# EAGLE design PCB (EAGLE 9.6.2)
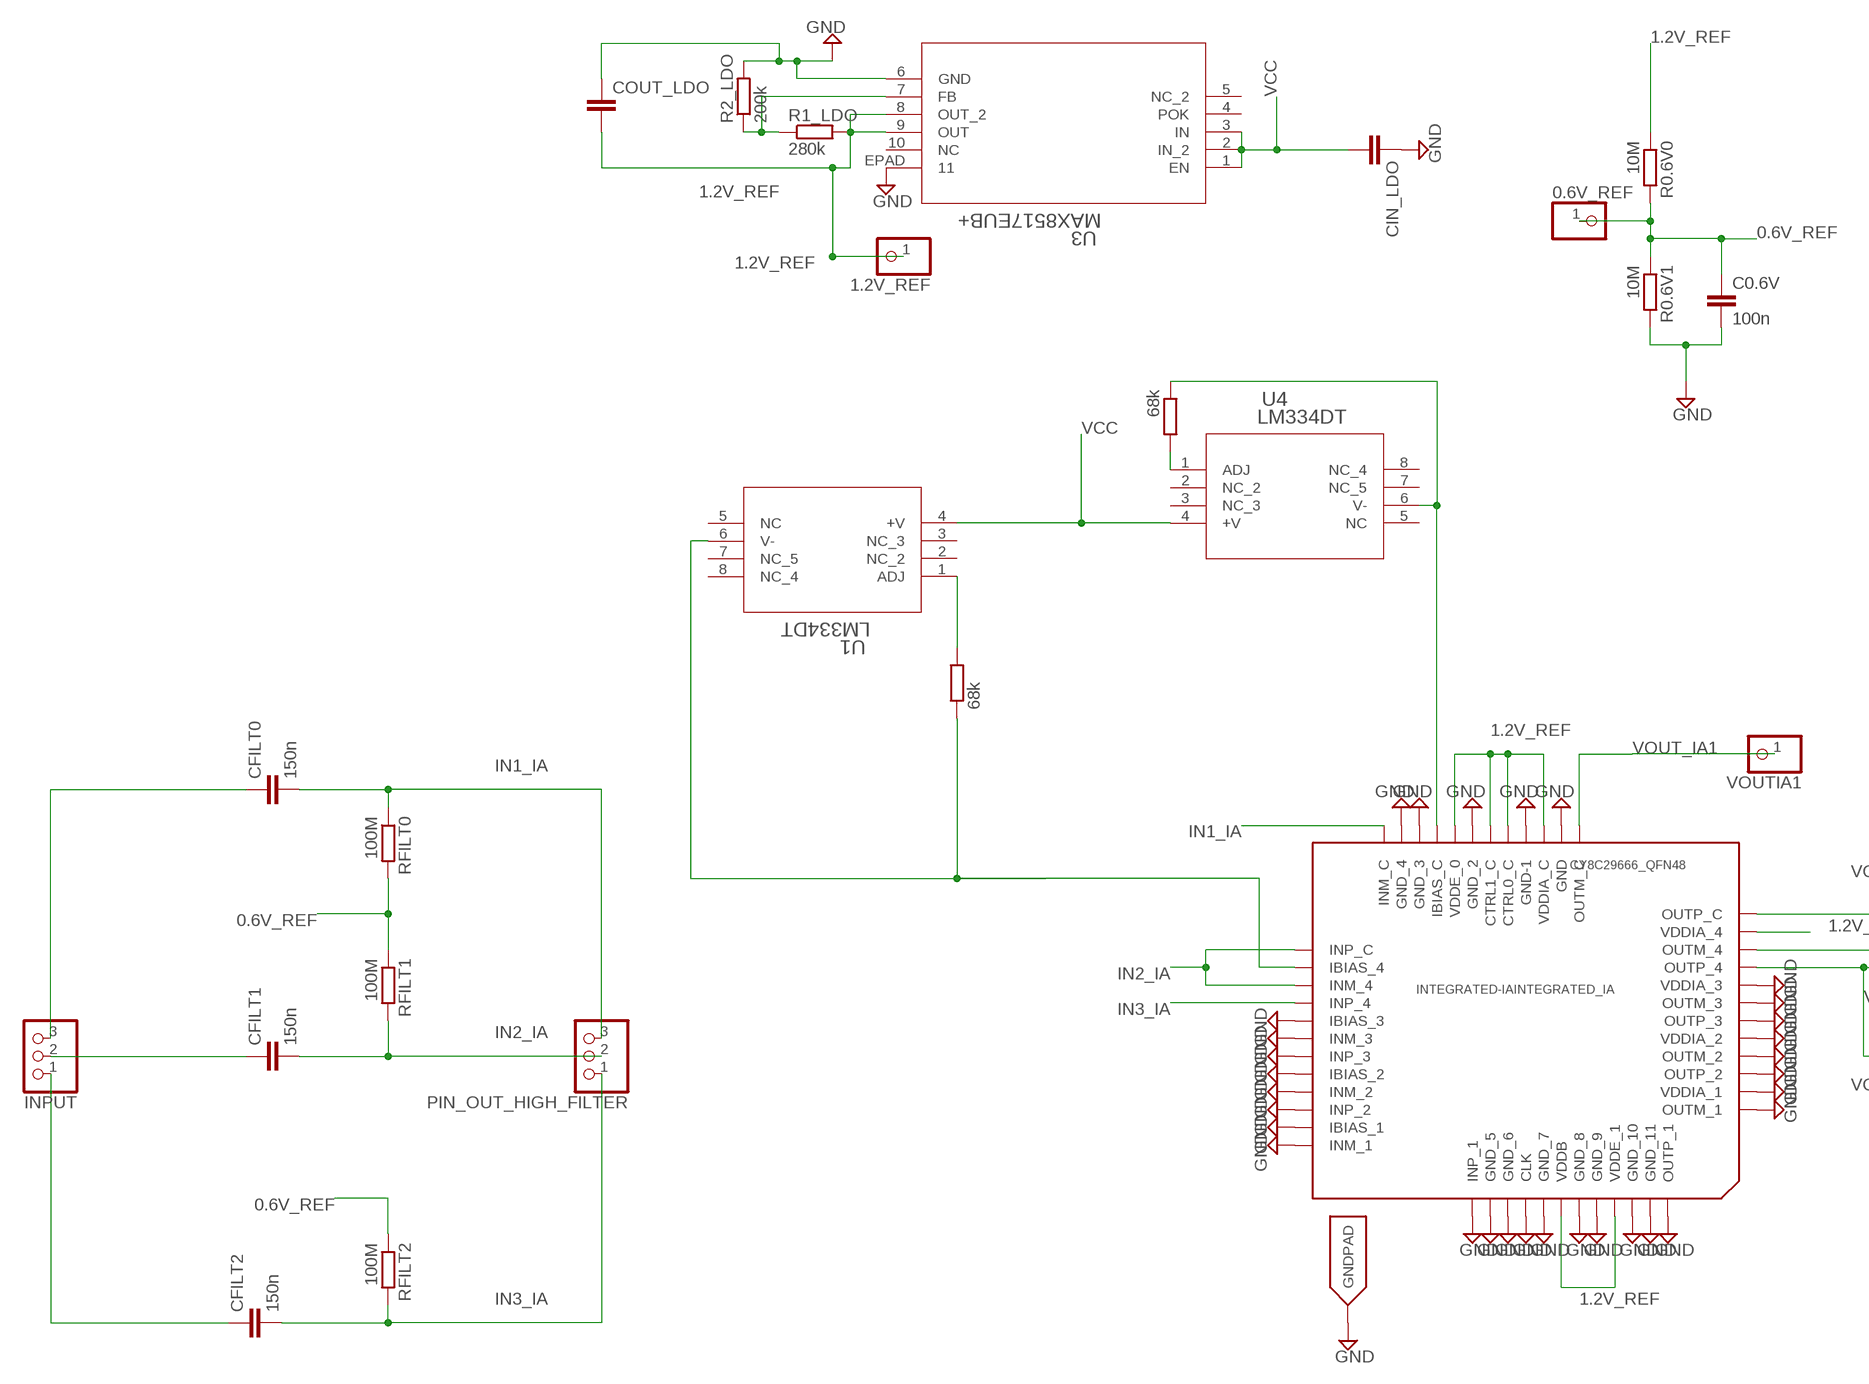
[diagram p0: schematic, sheet 1, part 1 of 2]
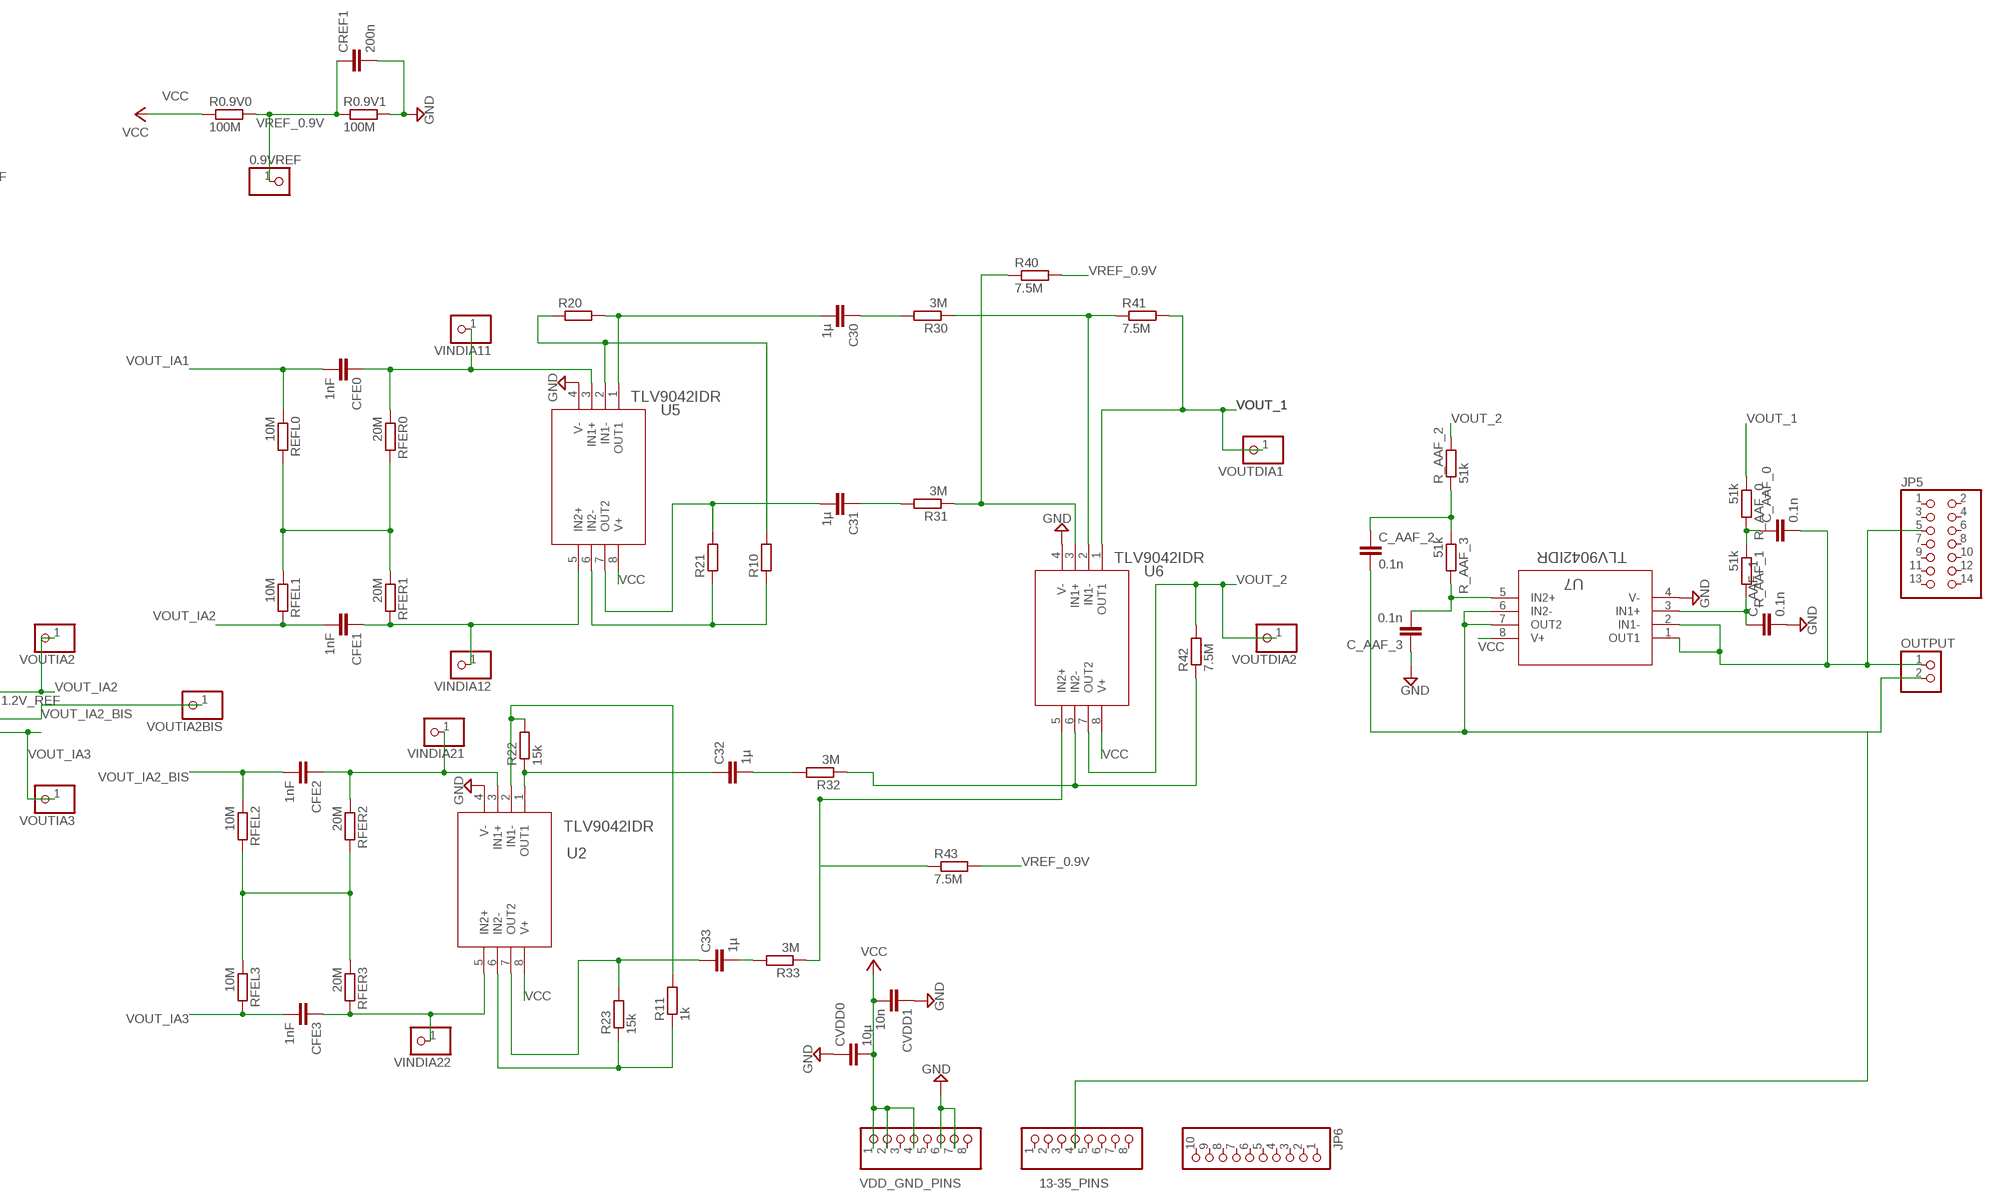
[diagram p1: schematic, sheet 1, part 2 of 2]

## Parts
0.6V_REF  PINHD-1X1  [1X01]
0.9VREF  PINHD-1X1  [1X01]
1.2V_REF  PINHD-1X1  [1X01]
13-35_PINS  PINHD-1X8  [1X08]
C0.6V  100n  C-EUC0603  [C0603]
C30  1µ  C-EUC0603  [C0603]
C31  1µ  C-EUC0603  [C0603]
C32  1µ  C-EUC0603  [C0603]
C33  1µ  C-EUC0603  [C0603]
C_AAF_0  0.1n  C-EUC0603  [C0603]
C_AAF_1  0.1n  C-EUC0603  [C0603]
C_AAF_2  0.1n  C-EUC0603  [C0603]
C_AAF_3  0.1n  C-EUC0603  [C0603]
CFE0  1nF  C-EUC0603  [C0603]
CFE1  1nF  C-EUC0603  [C0603]
CFE2  1nF  C-EUC0603  [C0603]
CFE3  1nF  C-EUC0603  [C0603]
CFILT0  150n  C-EUC0603  [C0603]
CFILT1  150n  C-EUC0603  [C0603]
CFILT2  150n  C-EUC0603  [C0603]
CIN_LDO  1µ  C-EUC0603  [C0603]
COUT_LDO  4.7µ  C-EUC0603  [C0603]
CREF1  200n  C-EUC0603  [C0603]
CVDD0  10µ  C-EUC0603  [C0603]
CVDD1  10n  C-EUC0603  [C0603]
INPUT  PINHD-1X3  [1X03]
INTEGRATED-IA  CY8C29666_QFN48  [QFN48]
JP5  PINHD-2X7  [2X07]
JP6  PINHD-1X10  [1X10]
OUTPUT  PINHD-1X2  [1X02]
PIN_OUT_HIGH_FILTER  PINHD-1X3  [1X03]
R0.6V0  10M  R-EU_R0603  [R0603]
R0.6V1  10M  R-EU_R0603  [R0603]
R0.9V0  100M  R-EU_R0603  [R0603]
R0.9V1  100M  R-EU_R0603  [R0603]
R1_LDO  280k  R-EU_R0603  [R0603]
R2_LDO  200k  R-EU_R0603  [R0603]
R10  R-EU_R0603  [R0603]
R11  1k  R-EU_R0603  [R0603]
R20  R-EU_R0603  [R0603]
R21  R-EU_R0603  [R0603]
R22  15k  R-EU_R0603  [R0603]
R23  15k  R-EU_R0603  [R0603]
R30  3M  R-EU_R0603  [R0603]
R31  3M  R-EU_R0603  [R0603]
R32  3M  R-EU_R0603  [R0603]
R33  3M  R-EU_R0603  [R0603]
R40  7.5M  R-EU_R0603  [R0603]
R41  7.5M  R-EU_R0603  [R0603]
R42  7.5M  R-EU_R0603  [R0603]
R43  7.5M  R-EU_R0603  [R0603]
R_AAF_0  51k  R-EU_R0603  [R0603]
R_AAF_1  51k  R-EU_R0603  [R0603]
R_AAF_2  51k  R-EU_R0603  [R0603]
R_AAF_3  51k  R-EU_R0603  [R0603]
REFL0  10M  R-EU_R0603  [R0603]
RFEL1  10M  R-EU_R0603  [R0603]
RFEL2  10M  R-EU_R0603  [R0603]
RFEL3  10M  R-EU_R0603  [R0603]
RFER0  20M  R-EU_R0603  [R0603]
RFER1  20M  R-EU_R0603  [R0603]
RFER2  20M  R-EU_R0603  [R0603]
RFER3  20M  R-EU_R0603  [R0603]
RFILT0  100M  R-EU_R0603  [R0603]
RFILT1  100M  R-EU_R0603  [R0603]
RFILT2  100M  R-EU_R0603  [R0603]
RLM334_0  68k  R-EU_R0603  [R0603]
RLM334_1  68k  R-EU_R0603  [R0603]
U1  LM334DT  [SO-8_STM]
U2  TLV9042IDR  [SOIC8_D_TEX]
U3  MAX8517EUB+  [21-0109D_MXM]
U4  LM334DT  [SO-8_STM]
U5  TLV9042IDR  [SOIC8_D_TEX]
U6  TLV9042IDR  [SOIC8_D_TEX]
U7  TLV9042IDR  [SOIC8_D_TEX]
VDD_GND_PINS  PINHD-1X8  [1X08]
VINDIA11  PINHD-1X1  [1X01]
VINDIA12  PINHD-1X1  [1X01]
VINDIA21  PINHD-1X1  [1X01]
VINDIA22  PINHD-1X1  [1X01]
VOUTDIA1  PINHD-1X1  [1X01]
VOUTDIA2  PINHD-1X1  [1X01]
VOUTIA1  PINHD-1X1  [1X01]
VOUTIA2  PINHD-1X1  [1X01]
VOUTIA2BIS  PINHD-1X1  [1X01]
VOUTIA3  PINHD-1X1  [1X01]

## Nets
0.6V_REF: 0.6V_REF.1 C0.6V.1 R0.6V0.2 R0.6V1.1 RFILT0.2 RFILT1.1 RFILT2.1
1.2V_REF: 1.2V_REF.1 COUT_LDO.2 INTEGRATED-IA.11(INTEGRATED_IA:VDDIA_4) INTEGRATED-IA.15(INTEGRATED_IA:VDDIA_C) INTEGRATED-IA.17(INTEGRATED_IA:CTRL0_C) INTEGRATED-IA.18(INTEGRATED_IA:CTRL1_C) INTEGRATED-IA.20(INTEGRATED_IA:VDDE_0) INTEGRATED-IA.42(INTEGRATED_IA:VDDB) INTEGRATED-IA.45(INTEGRATED_IA:VDDE_1) R0.6V0.1 R1_LDO.2 U3.8(OUT_2) U3.9(OUT)
GND: C0.6V.2 C_AAF_1.2 C_AAF_3.1 CIN_LDO.1 COUT_LDO.1 CREF1.2 CVDD0.1 CVDD1.1 INTEGRATED-IA.1(INTEGRATED_IA:OUTM_1) INTEGRATED-IA.2(INTEGRATED_IA:VDDIA_1) INTEGRATED-IA.3(INTEGRATED_IA:OUTP_2) INTEGRATED-IA.4(INTEGRATED_IA:OUTM_2) INTEGRATED-IA.5(INTEGRATED_IA:VDDIA_2) INTEGRATED-IA.6(INTEGRATED_IA:OUTP_3) INTEGRATED-IA.7(INTEGRATED_IA:OUTM_3) INTEGRATED-IA.8(INTEGRATED_IA:VDDIA_3) INTEGRATED-IA.14(INTEGRATED_IA:GND) INTEGRATED-IA.16(INTEGRATED_IA:GND-1) INTEGRATED-IA.19(INTEGRATED_IA:GND_2) INTEGRATED-IA.22(INTEGRATED_IA:GND_3) INTEGRATED-IA.23(INTEGRATED_IA:GND_4) INTEGRATED-IA.29(INTEGRATED_IA:IBIAS_3) INTEGRATED-IA.30(INTEGRATED_IA:INM_3) INTEGRATED-IA.31(INTEGRATED_IA:INP_3) INTEGRATED-IA.32(INTEGRATED_IA:IBIAS_2) INTEGRATED-IA.33(INTEGRATED_IA:INM_2) INTEGRATED-IA.34(INTEGRATED_IA:INP_2) INTEGRATED-IA.35(INTEGRATED_IA:IBIAS_1) INTEGRATED-IA.36(INTEGRATED_IA:INM_1) INTEGRATED-IA.37(INTEGRATED_IA:INP_1) INTEGRATED-IA.38(INTEGRATED_IA:GND_5) INTEGRATED-IA.39(INTEGRATED_IA:GND_6) INTEGRATED-IA.40(INTEGRATED_IA:CLK) INTEGRATED-IA.41(INTEGRATED_IA:GND_7) INTEGRATED-IA.43(INTEGRATED_IA:GND_8) INTEGRATED-IA.44(INTEGRATED_IA:GND_9) INTEGRATED-IA.46(INTEGRATED_IA:GND_10) INTEGRATED-IA.47(INTEGRATED_IA:GND_11) INTEGRATED-IA.48(INTEGRATED_IA:OUTP_1) INTEGRATED-IA.EXP(GNDPAD) R0.6V1.2 R0.9V1.2 R2_LDO.2 U2.4(V-) U3.6(GND) U3.EPAD U5.4(V-) U6.4(V-) U7.4(V-) VDD_GND_PINS.6 VDD_GND_PINS.7
IN1_IA: CFILT0.2 INTEGRATED-IA.24(INTEGRATED_IA:INM_C) PIN_OUT_HIGH_FILTER.3 RFILT0.1
IN2_IA: CFILT1.2 INTEGRATED-IA.25(INTEGRATED_IA:INP_C) INTEGRATED-IA.27(INTEGRATED_IA:INM_4) PIN_OUT_HIGH_FILTER.2 RFILT1.2
IN3_IA: CFILT2.2 INTEGRATED-IA.28(INTEGRATED_IA:INP_4) PIN_OUT_HIGH_FILTER.1 RFILT2.2
N$1: C33.2 R33.2
N$2: C32.1 R22.1 U2.1(OUT1)
N$3: C32.2 R32.2
N$4: R32.1 R42.1 U6.6(IN2-)
N$5: CFILT2.1 INPUT.1
N$6: R33.1 R43.1 U6.5(IN2+)
N$7: REFL0.2 RFEL1.1 RFER0.2 RFER1.1
N$8: R31.1 R40.1 U6.3(IN1+)
N$9: C31.1 R31.2
N$10: C30.1 R30.2
N$11: C31.2 R21.2 U5.7(OUT2)
N$12: RLM334_1.2 U1.1(ADJ)
N$14: CFILT0.1 INPUT.3
N$16: R1_LDO.1 R2_LDO.1 U3.7(FB)
N$17: RLM334_0.2 U4.1(ADJ)
N$18: C_AAF_2.1 R_AAF_2.1 R_AAF_3.1
N$20: C30.2 R20.2 U5.1(OUT1)
N$21: C_AAF_0.1 R_AAF_0.2 R_AAF_1.1
N$22: C_AAF_1.1 R_AAF_1.2 U7.3(IN1+)
N$23: C_AAF_3.2 R_AAF_3.2 U7.5(IN2+)
N$24: 13-35_PINS.4 C_AAF_2.2 OUTPUT.2 U7.6(IN2-) U7.7(OUT2)
N$25: C_AAF_0.2 JP5.5 OUTPUT.1 U7.1(OUT1) U7.2(IN1-)
N$26: R30.1 R41.1 U6.2(IN1-)
N$27: R10.1 R21.1 U5.6(IN2-)
N$28: C33.1 R23.2 U2.7(OUT2)
N$29: R11.1 R23.1 U2.6(IN2-)
N$30: R10.2 R20.1 U5.2(IN1-)
N$31: INTEGRATED-IA.26(INTEGRATED_IA:IBIAS_4) RLM334_1.1 U1.6(V-)
N$32: R11.2 R22.2 U2.2(IN1-)
N$33: CFE3.1 RFER3.2 U2.5(IN2+) VINDIA22.1
N$34: RFEL2.2 RFEL3.1 RFER2.2 RFER3.1
N$36: CFE2.1 RFER2.1 U2.3(IN1+) VINDIA21.1
N$38: INTEGRATED-IA.21(INTEGRATED_IA:IBIAS_C) RLM334_0.1 U4.6(V-)
N$39: CFE0.1 RFER0.1 U5.3(IN1+) VINDIA11.1
N$40: CFE1.1 RFER1.2 U5.5(IN2+) VINDIA12.1
N$45: CFILT1.1 INPUT.2
VCC: CIN_LDO.2 CVDD0.2 CVDD1.2 R0.9V0.1 U1.4(+V) U2.8(V+) U3.1(EN) U3.2(IN_2) U3.3(IN) U4.4(+V) U5.8(V+) U6.8(V+) U7.8(V+) VDD_GND_PINS.1 VDD_GND_PINS.2 VDD_GND_PINS.4
VOUT_1: R41.2 R_AAF_0.1 U6.1(OUT1) VOUTDIA1.1
VOUT_2: R42.2 R_AAF_2.2 U6.7(OUT2) VOUTDIA2.1
VOUT_IA1: CFE0.2 INTEGRATED-IA.13(INTEGRATED_IA:OUTM_C) REFL0.1 VOUTIA1.1
VOUT_IA2: CFE1.2 INTEGRATED-IA.12(INTEGRATED_IA:OUTP_C) RFEL1.2 VOUTIA2.1
VOUT_IA2_BIS: CFE2.2 INTEGRATED-IA.10(INTEGRATED_IA:OUTM_4) RFEL2.1 VOUTIA2BIS.1
VOUT_IA3: CFE3.2 INTEGRATED-IA.9(INTEGRATED_IA:OUTP_4) RFEL3.2 VOUTIA3.1
VREF_0.9V: 0.9VREF.1 CREF1.1 R0.9V0.2 R0.9V1.1 R40.2 R43.2
Unconnected: 13-35_PINS.1 13-35_PINS.2 13-35_PINS.3 13-35_PINS.5 13-35_PINS.6 13-35_PINS.7 13-35_PINS.8 JP5.1 JP5.2 JP5.3 JP5.4 JP5.6 JP5.7 JP5.8 JP5.9 JP5.10 JP5.11 JP5.12 JP5.13 JP5.14 JP6.1 JP6.2 JP6.3 JP6.4 JP6.5 JP6.6 JP6.7 JP6.8 JP6.9 JP6.10 U1.2(NC_2) U1.3(NC_3) U1.5(NC) U1.7(NC_5) U1.8(NC_4) U3.4(POK) U3.5(NC_2) U3.10(NC) U4.2(NC_2) U4.3(NC_3) U4.5(NC) U4.7(NC_5) U4.8(NC_4) VDD_GND_PINS.3 VDD_GND_PINS.5 VDD_GND_PINS.8

## Library data of the parts
0.6V_REF 0.9VREF 1.2V_REF VINDIA11 VINDIA12 VINDIA21 VINDIA22 VOUTDIA1 VOUTDIA2 VOUTIA1 VOUTIA2 VOUTIA2BIS VOUTIA3 = pinhead:PINHD-1X1: PIN HEADER
13-35_PINS VDD_GND_PINS = pinhead:PINHD-1X8: PIN HEADER
C0.6V C30-C33 C_AAF_0 C_AAF_1-C_AAF_3 CFE0 CFE1-CFE3 CFILT0 CFILT1 CFILT2 CIN_LDO COUT_LDO CREF1 CVDD0 CVDD1 = rcl:C-EU: CAPACITOR, European symbol; SPICEPREFIX: C
INPUT PIN_OUT_HIGH_FILTER = pinhead:PINHD-1X3: PIN HEADER
INTEGRATED-IA = cypresspsoc_0.30:CY8C29666_QFN48
JP5 = pinhead:PINHD-2X7: PIN HEADER
JP6 = pinhead:PINHD-1X10: PIN HEADER
OUTPUT = pinhead:PINHD-1X2: PIN HEADER
R0.6V0 R0.6V1 R0.9V0 R0.9V1 R1_LDO R2_LDO R10 R11 R20-R23 R30-R33 R40-R43 R_AAF_0 R_AAF_1-R_AAF_3 REFL0 RFEL1-RFEL3 RFER0 RFER1-RFER3 RFILT0 RFILT1 RFILT2 RLM334_0 RLM334_1 = rcl:R-EU_: RESISTOR, European symbol; SPICEPREFIX: R
U1 U4 = Curren_Ref:LM334DT; BUILT_BY: EMA_UL_Team; MANUFACTURER_PART_NUMBER: LM334DT; SOURCELIBRARY: Update_to_database_2020-11-24; VENDOR: STMicroelectronics
U2 U5-U7 = TLV9042_With_PINS:TLV9042IDR; BUILT_BY: EMA_Cory; COPYRIGHT: Copyright (C) 2018 Accelerated Designs. All rights reserved; DATASHEET: https://www.ti.com/lit/ds/symlink/tlv9042.pdf?ts=1614267059947&ref_url=https%253A%252F%252Fwww.ti.com%252Fstore%252Fti%252Fen%252Fp%252Fproduct%252F%253Fp%253DTLV9042IDR; MANUFACTURER_PART_NUMBER: TLV9042IDR; SOURCELIBRARY: Add_to_database_2021-02-25; VENDOR: Texas Instruments
U3 = LDO:MAX8517EUB+; BUILT_BY: EMA_UL_Team; MANUFACTURER_PART_NUMBER: MAX8517EUB+; REVISION: 3; SOURCELIBRARY: Maxim_2011-05-13; VENDOR: Maxim Integrated Products

## Board
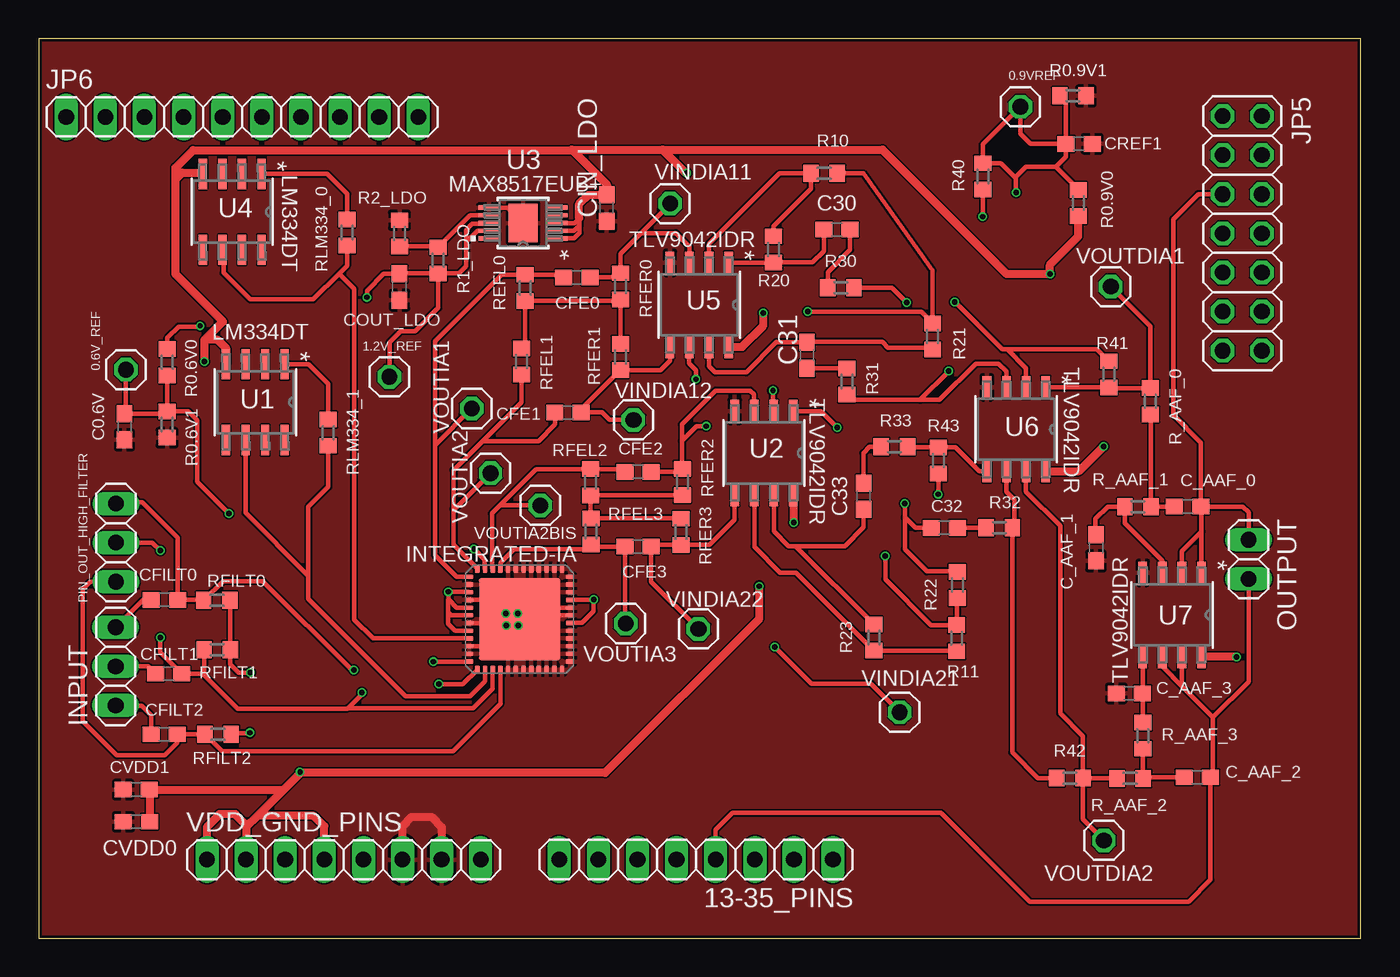
[diagram p2: board, top side]
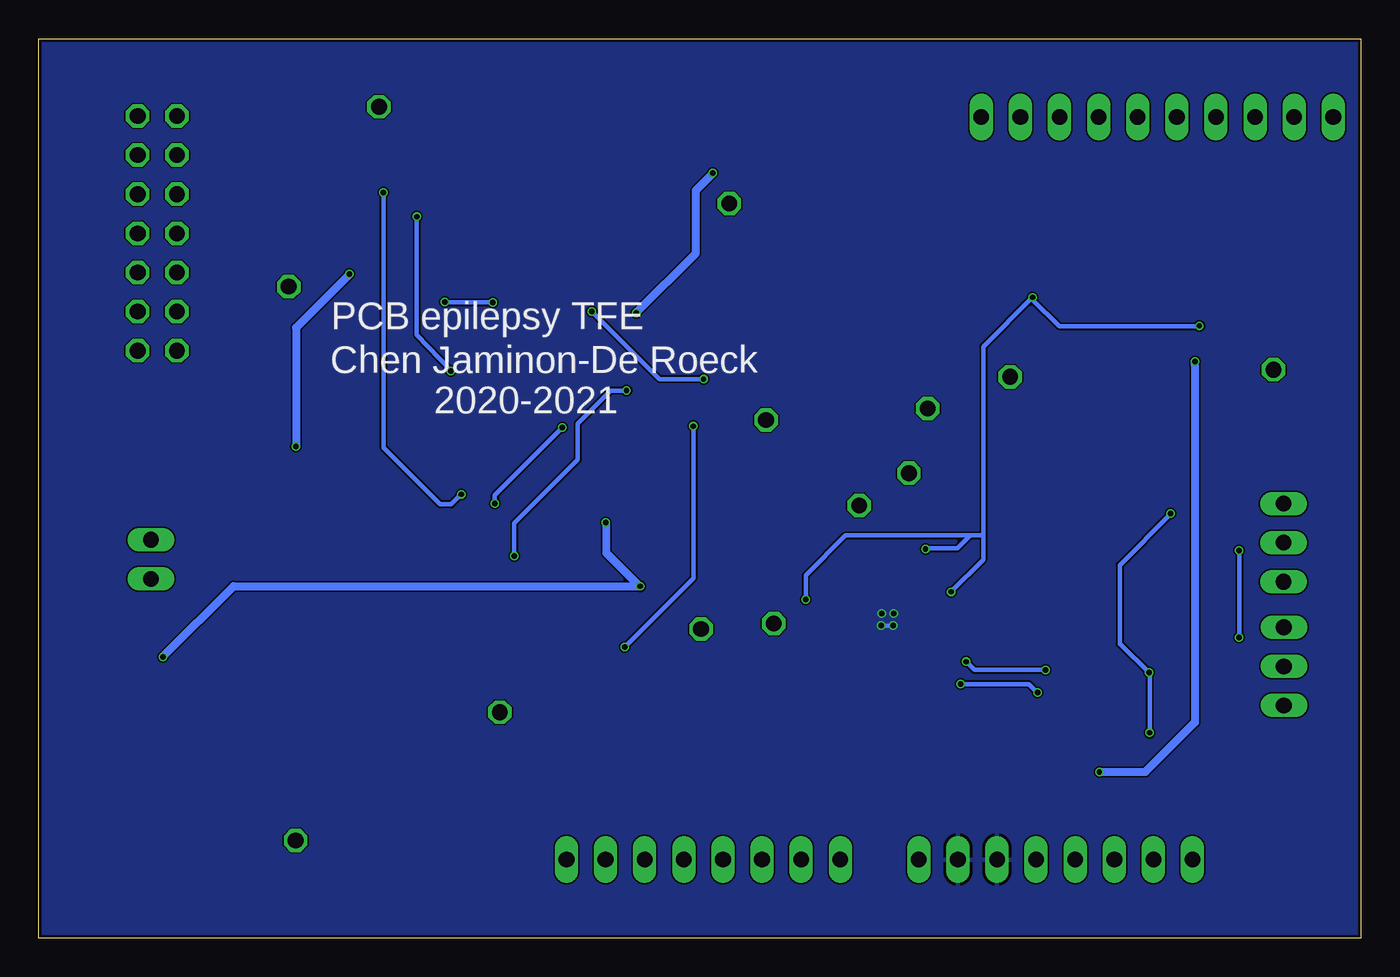
[diagram p3: board, bottom side, seen from below]

Size 85.89 x 58.42 mm. Coordinates in mm from the lower left corner, seen from the top.
Outline: 0,0.02 85.88,0 85.89,58.42 0.01,58.42 0,0.02
Copper layers (1*16): Top 0.018mm / dielectric 1.55mm / Bottom 0.018mm
Design rules "Multi-CB_2L_100µm-Tracks_OL35µm": minimum track width 0.1mm, minimum drill 0.2mm, track to track 0.1mm, track to pad 0.1mm, pad to pad 0.1mm, via to via 0.1mm, smd to smd 0mil, copper to edge 0.2mm, drill to drill 0.2mm, minimum pad ring 0.125mm, minimum via ring 0.1mm, stop-mask expansion 2mil, vias tented up to drill 0.45mm, thermal gap 0.2mm

### Footprints (pad centres in the part's own frame; a part is rotated, then mirrored left to right if it is on the bottom)
1X01 = drill 1.016 octagon: 1 0,0
1X08 = drill 1.016 long: 1 -8.89,0; 2 -6.35,0; 3 -3.81,0; 4 -1.27,0; 5 1.27,0; 6 3.81,0; 7 6.35,0; 8 8.89,0
C0603 = smd 1.1 x 1: 1 -0.85,0; 2 0.85,0
1X03 = drill 1.016 long: 1 -2.54,0; 2 0,0; 3 2.54,0
QFN48 = smd 0.55 x 0.3: 1 -3.275,2.75; 2 -3.275,2.25; 3 -3.275,1.75; 4 -3.275,1.25; 5 -3.275,0.75; 6 -3.275,0.25; 7 -3.275,-0.25; 8 -3.275,-0.75; 9 -3.275,-1.25; 10 -3.275,-1.75; 11 -3.275,-2.25; 12 -3.275,-2.75; 25 3.275,-2.75; 26 3.275,-2.25; 27 3.275,-1.75; 28 3.275,-1.25; 29 3.275,-0.75; 30 3.275,-0.25; 31 3.275,0.25; 32 3.275,0.75; 33 3.275,1.25; 34 3.275,1.75; 35 3.275,2.25; 36 3.275,2.75 | smd 0.3 x 0.55: 13 -2.75,-3.275; 14 -2.25,-3.275; 15 -1.75,-3.275; 16 -1.25,-3.275; 17 -0.75,-3.275; 18 -0.25,-3.275; 19 0.25,-3.275; 20 0.75,-3.275; 21 1.25,-3.275; 22 1.75,-3.275; 23 2.25,-3.275; 24 2.75,-3.275; 37 2.75,3.275; 38 2.25,3.275; 39 1.75,3.275; 40 1.25,3.275; 41 0.75,3.275; 42 0.25,3.275; 43 -0.25,3.275; 44 -0.75,3.275; 45 -1.25,3.275; 46 -1.75,3.275; 47 -2.25,3.275; 48 -2.75,3.275 | smd 5.309 x 5.309: EXP 0,0
2X07 = drill 1.016 octagon: 1 -7.62,-1.27; 2 -7.62,1.27; 3 -5.08,-1.27; 4 -5.08,1.27; 5 -2.54,-1.27; 6 -2.54,1.27; 7 0,-1.27; 8 0,1.27; 9 2.54,-1.27; 10 2.54,1.27; 11 5.08,-1.27; 12 5.08,1.27; 13 7.62,-1.27; 14 7.62,1.27
1X10 = drill 1.016 long: 1 -11.43,0; 2 -8.89,0; 3 -6.35,0; 4 -3.81,0; 5 -1.27,0; 6 1.27,0; 7 3.81,0; 8 6.35,0; 9 8.89,0; 10 11.43,0
1X02 = drill 1.016 long: 1 -1.27,0; 2 1.27,0
R0603 = smd 1 x 1.1: 1 -0.85,0; 2 0.85,0
SO-8_STM = smd 1.97 x 0.533: 1 -2.464,1.905; 2 -2.464,0.635; 3 -2.464,-0.635; 4 -2.464,-1.905; 5 2.464,-1.905; 6 2.464,-0.635; 7 2.464,0.635; 8 2.464,1.905
SOIC8_D_TEX = smd 1.46 x 0.559: 1 -2.724,1.905; 2 -2.724,0.635; 3 -2.724,-0.635; 4 -2.724,-1.905; 5 2.724,-1.905; 6 2.724,-0.635; 7 2.724,0.635; 8 2.724,1.905
21-0109D_MXM = smd 1.353 x 0.279: 1 -2.201,1; 2 -2.201,0.5; 3 -2.201,0; 4 -2.201,-0.5; 5 -2.201,-1; 6 2.201,-1; 7 2.201,-0.5; 8 2.201,0; 9 2.201,0.5; 10 2.201,1 | smd 1.88 x 2.515: EPAD 0,0

### Placement (x,y rotation side)
0.6V_REF  5.68,36.92 0 top
0.9VREF  63.77,53.99 0 top
1.2V_REF  22.79,36.46 0 top
13-35_PINS  42.71,5.12 180 top
C0.6V  5.58,33.21 270 top
C30  51.86,46.02 180 top
C31  49.91,37.85 90 top
C32  58.84,26.65 0 top
C33  53.59,28.7 90 top
C_AAF_0  74.63,28.03 0 top
C_AAF_1  68.68,25.36 270 top
C_AAF_2  75.26,10.46 0 top
C_AAF_3  70.85,15.91 0 top
CFE0  34.96,42.91 180 top
CFE1  34.38,34.14 180 top
CFE2  38.94,30.29 180 top
CFE3  38.94,25.44 180 top
CFILT0  8.18,21.98 0 top
CFILT1  8.45,17.18 0 top
CFILT2  8.16,13.25 0 top
CIN_LDO  36.9,47.42 90 top
COUT_LDO  23.44,42.29 90 top
CREF1  67.58,51.58 0 top
CVDD0  6.36,7.57 0 top
CVDD1  6.35,9.66 0 top
INPUT  5.01,17.66 90 top
INTEGRATED-IA  31.25,20.72 270 top
JP5  78.18,45.77 270 top
JP6  13.23,53.33 0 top
OUTPUT  78.59,24.61 270 top
PIN_OUT_HIGH_FILTER  5.03,25.69 90 top
R0.6V0  8.37,37.4 270 top
R0.6V1  8.35,33.36 270 top
R0.9V0  67.53,47.74 90 top
R0.9V1  67.18,54.69 0 top
R1_LDO  25.96,44.02 270 top
R2_LDO  23.44,45.77 90 top
R10  51.03,49.67 180 top
R11  59.63,19.49 90 top
R20  47.74,44.73 270 top
R21  58.07,39.08 270 top
R22  59.67,22.94 270 top
R23  54.25,19.53 90 top
R30  52.11,42.23 180 top
R31  52.5,36.15 90 top
R32  62.4,26.66 180 top
R33  55.59,31.93 180 top
R40  61.32,49.47 90 top
R41  69.5,36.62 270 top
R42  66.98,10.41 0 top
R43  58.44,31.02 270 top
R_AAF_0  72.22,34.87 270 top
R_AAF_1  71.4,28.02 180 top
R_AAF_2  70.9,10.38 180 top
R_AAF_3  71.73,13.16 90 top
REFL0  31.6,42.23 270 top
RFEL1  31.37,37.45 270 top
RFEL2  35.85,29.61 270 top
RFEL3  35.89,26.41 270 top
RFER0  37.81,42.33 270 top
RFER1  37.79,37.75 270 top
RFER2  41.82,29.63 270 top
RFER3  41.74,26.39 270 top
RFILT0  11.58,21.95 0 top
RFILT1  11.61,18.75 180 top
RFILT2  11.66,13.26 180 top
RLM334_0  20.03,45.82 90 top
RLM334_1  18.82,32.83 90 top
U1  14.08,34.81 270 top
U2  47.12,31.51 270 top
U3  31.47,46.44 180 top
U4  12.58,47.17 270 top
U5  42.91,41.13 270 top
U6  63.5,33.05 270 top
U7  73.62,21 270 top
VDD_GND_PINS  19.83,5.11 0 top
VINDIA11  41.02,47.7 0 top
VINDIA12  38.64,33.66 0 top
VINDIA21  55.93,14.68 0 top
VINDIA22  42.86,20.09 0 top
VOUTDIA1  69.64,42.31 0 top
VOUTDIA2  69.19,6.36 0 top
VOUTIA1  28.14,34.4 0 top
VOUTIA2  29.36,30.2 0 top
VOUTIA2BIS  32.59,28.11 0 top
VOUTIA3  38.13,20.44 0 top

### Tracks (layer width: path | path; a pad name or v marks a point on that pad's centre or on a via)
0.6V_REF  (via drill 0.35)
  Top 0.305: R0.6V1.1 8.35,36.53 R0.6V0.2 | C0.6V.1 5.63,34.06 | 5.63,34.06 8.2,34.06 R0.6V1.1 | v13.73,13.35 13.71,13.33 12.58,13.33 RFILT2.1 | RFILT0.2 12.46,21.92 RFILT1.1 12.46,17.79 13,17.25 v13.77,17.25 | v12.37,27.58 10.29,29.66 10.29,33.65 9.73,34.21 R0.6V1.1 | 0.6V_REF.1 5.68,34.11 5.63,34.06
  Bottom 0.305: v13.73,13.35 13.73,17.2 | 13.73,17.2 13.73,17.21 v13.77,17.25 | v12.37,27.58 v12.38,27.57 12.38,27.52 15.67,24.23 15.67,19.11 15.66,19.12 13.73,17.2
1.2V_REF  (via drill 0.35)
  Top 0.305: R1_LDO.2 23.47,43.17 COUT_LDO.2 22.41,43.14 21.33,42.06 v21.33,41.62 | R1_LDO.2 27.32,43.17 27.77,43.62 27.77,45.21 | INTEGRATED-IA.15 27.95,22.5 v26.62,22.5 26.62,22.01 | U3.8 29.21,46.38 28.17,46.38 27.77,45.98 27.77,45.21 | U3.9 28.5,45.94 27.77,45.21 | v28.29,25.29 28.99,24.59 28.99,24.01 INTEGRATED-IA.11 | R0.6V0.1 8.37,38.99 9.1,39.72 10.45,39.72 v10.5,39.77 | INTEGRATED-IA.45 34.55,21.99 v36.06,21.99 36.06,21.25 35.31,20.5 34.56,20.5 INTEGRATED-IA.42 | INTEGRATED-IA.17 27.16,21.47 26.62,22.01 | INTEGRATED-IA.18 26.8,20.97 26.61,21.16 | 26.61,21.16 26.61,22 26.62,22.01 | INTEGRATED-IA.20 27.07,19.97 26.61,20.43 26.61,21.16 | R1_LDO.2 25.96,40.93 24.45,39.42 23.52,39.42 22.79,38.69 1.2V_REF.1
  Bottom 0.305: 24.53,26.16 24.53,38.42 v21.33,41.62 21.33,41.47 19.6,39.74 10.5,39.74 v10.5,39.77 | v36.06,21.99 36.06,23.57 33.47,26.16 25.38,26.16 | 25.38,26.16 24.53,26.16 | 24.53,26.16 24.53,24.59 v26.62,22.5 | 25.38,26.16 26.21,25.33 28.25,25.33 v28.29,25.29
GND  (via drill 0.35)
  Top 0.305: INTEGRATED-IA.EXP 30.73,20.72 v30.36,21.09 | INTEGRATED-IA.EXP 30,21.97 INTEGRATED-IA.16 | INTEGRATED-IA.EXP 32,21.47 INTEGRATED-IA.44 | INTEGRATED-IA.EXP 31.5,20.97 INTEGRATED-IA.43 | INTEGRATED-IA.19 30.23,20.47 v30.39,20.31 | INTEGRATED-IA.22 29.05,18.97 v30.39,20.31 | INTEGRATED-IA.EXP 31.14,20.83 v31.14,21.08 | INTEGRATED-IA.EXP 30.8,20.72 v30.39,20.31 | INTEGRATED-IA.EXP 31.16,20.63 v31.16,20.31 | U3.6 30.47,47.44 U3.EPAD
  Top 0.508: VDD_GND_PINS.6 23.64,7.29 24.23,7.88 25.52,7.88 26.18,7.22 VDD_GND_PINS.7
  Bottom 0.305: v31.16,20.31 v30.39,20.31
  pour Bottom: 0.13,58.16 85.79,58.16 85.87,0 0.13,0.1
  pour Top: 0.17,58.26 85.63,58.26 85.63,0.17 85.57,0.11 0.17,0.11
IN1_IA  (via drill 0.35)
  Top 0.305: v25.64,17.96 v25.65,17.97 INTEGRATED-IA.24 | v20.47,17.43 20.34,17.43 14.57,23.2 11.98,23.2 RFILT0.1 10.7,21.98 CFILT0.2 9.03,26.02 6.75,28.3 5.16,28.3 5.09,28.23 PIN_OUT_HIGH_FILTER.3
  Bottom 0.305: v25.64,17.96 25.11,17.43 v20.47,17.43
IN2_IA  (via drill 0.35)
  Top 0.305: v26.01,16.51 26.04,16.48 27.54,16.48 INTEGRATED-IA.25 | INTEGRATED-IA.27 29.5,16.21 28.23,14.94 20.05,14.94 20.07,14.92 | 10.76,17.09 12.93,14.92 20.07,14.92 | v21.01,15.95 21.01,15.86 20.07,14.92 | RFILT1.2 10.76,17.09 | 10.76,17.09 10.67,17.18 CFILT1.2 7.91,18.57 v7.91,19.52 | v7.92,25.17 7.4,25.69 PIN_OUT_HIGH_FILTER.2
  Bottom 0.305: v21.01,15.95 21.57,16.51 v26.01,16.51 | v7.92,25.17 v7.91,25.16 v7.91,19.52
IN3_IA
  Top 0.305: INTEGRATED-IA.28 30,15.23 26.92,12.15 11.92,12.15 RFILT2.2 CFILT2.2 9.01,12.7 8.19,11.88 5.08,11.88 2.87,14.09 2.87,22.65 3.37,23.15 PIN_OUT_HIGH_FILTER.1
N$1
  Top 0.305: R33.2 53.98,31.93 53.56,31.51 53.56,29.58 C33.2
N$2  (via drill 0.35)
  Top 0.305: R22.1 59.64,23.82 57.69,23.82 56.26,25.25 56.26,27.33 | v56.26,28.23 56.26,27.33 | U2.1 50.81,34.23 v51.88,33.16 | C32.1 56.94,26.65 56.26,27.33
  Bottom 0.305: v56.26,28.23 56.26,28.76 51.88,33.14 v51.88,33.16
N$3
  Top 0.305: C32.2 R32.2
N$4
  Top 0.305: R42.1 64.91,10.41 63.24,12.08 R32.1 63.25,26.76 63.37,26.88 63.37,28.49 62.87,29 U6.6
N$5
  Top 0.305: INPUT.1 6.7,15.11 7.31,14.5 CFILT2.1
N$6
  Top 0.305: R33.1 56.5,31.87 R43.1 59.55,31.87 61.09,30.33 U6.5
N$7
  Top 0.305: RFER1.1 37.79,41.46 RFER0.2 37.71,41.38 REFL0.2 31.6,38.53 RFEL1.1
N$8  (via drill 0.35)
  Top 0.305: R31.1 52.84,34.96 57.26,34.96 | 57.26,34.96 58.52,34.96 60.88,37.32 62.35,37.32 62.87,36.8 U6.3 | v59.1,36.84 59.1,36.77 57.26,34.96 | R40.1 v61.32,46.85
  Bottom 0.305: v61.32,46.85 61.32,39.2 v59.1,36.84
N$9
  Top 0.305: C31.1 R31.2
N$10
  Top 0.305: R30.2 51.26,43.24 52.71,44.69 C30.1
N$11
  Top 0.305: R21.2 57.96,38.34 55.18,38.34 54.8,38.72 49.93,38.72 C31.2 47.96,38.7 47.94,38.72 45.97,36.75 43.95,36.75 43.55,37.16 U5.7
N$12
  Top 0.305: RLM334_1.2 18.82,36 17.55,37.27 U1.1
N$14
  Top 0.305: INPUT.3 6.79,21.98 CFILT0.1
N$16
  Top 0.305: R2_LDO.1 25.91,44.92 R1_LDO.1 28.03,46.94 U3.7
N$17
  Top 0.305: RLM334_0.2 20.03,48.31 20.05,48.33 18.75,49.63 U4.1
N$18
  Top 0.305: C_AAF_2.1 71.83,10.46 R_AAF_2.1 71.73,10.4 R_AAF_3.1
N$20
  Top 0.305: U5.1 47.71,43.85 R20.2 50.28,43.88 51.01,44.61 C30.2
N$21
  Top 0.305: C_AAF_0.1 R_AAF_1.1 72.25,33.99 R_AAF_0.2
N$22
  Top 0.305: C_AAF_1.1 68.65,26.24 68.65,27.23 69.44,28.02 R_AAF_1.2 70.55,26.95 72.98,24.51 U7.3
N$23
  Top 0.305: R_AAF_3.2 71.72,15.68 71.72,15.69 71.72,15.89 | 71.72,15.89 C_AAF_3.2 | U7.5 71.72,15.89
N$24
  Top 0.305: 76.28,14.35 76.28,10.63 C_AAF_2.2 76.11,3.79 74.7,2.38 64.37,2.38 58.61,8.14 45.08,8.14 43.98,7.04 13-35_PINS.4 | U7.7 74.26,16.38 | 76.28,14.35 74.26,16.38 | OUTPUT.2 78.59,16.66 76.28,14.35 | U7.6 73.01,18.28 73.01,17.62 74.26,16.38
N$25
  Top 0.305: OUTPUT.1 78.59,27.65 78.21,28.03 C_AAF_0.2 | U7.1 75.53,26.4 | 75.53,26.4 75.53,27.98 C_AAF_0.2 | 75.53,26.4 75.51,26.4 74.26,25.14 U7.2 | C_AAF_0.2 75.48,32.19 73.69,33.98 73.69,46.69 75.31,48.31 JP5.5
N$26  (via drill 0.35)
  Top 0.305: R41.1 68.73,38.24 62.91,38.24 | 62.91,38.24 62.59,38.24 v59.51,41.32 | v56.38,41.29 55.44,42.23 R30.1 | U6.2 64.14,37.02 62.91,38.24
  Bottom 0.305: v59.51,41.32 59.48,41.29 v56.38,41.29
N$27  (via drill 0.35)
  Top 0.305: R10.1 53.57,49.67 58.07,43.37 R21.1 57.34,40.66 49.93,40.66 v49.95,40.69 | U5.6 42.25,38.39 42.25,37.33 42.7,36.88 v42.7,36.3
  Bottom 0.305: v42.7,36.3 45.55,36.3 49.12,39.87 49.13,39.87 v49.95,40.69
N$28
  Top 0.305: U2.7 47.76,26.43 48.71,25.47 49.16,25.47 | R23.2 49.16,25.47 | 49.16,25.47 52.38,25.47 53.59,26.68 C33.1
N$29
  Top 0.305: R11.1 59.59,18.68 R23.1 49.18,23.75 48.16,23.75 46.48,25.43 U2.6
N$30
  Top 0.305: R20.1 47.74,46.22 50.18,48.66 R10.2 48.13,49.67 43.55,45.09 U5.2
N$31
  Top 0.305: 17.52,23.58 17.52,28.01 18.82,29.31 RLM334_1.1 | 17.52,23.58 17.52,22.05 23.85,15.72 28.02,15.72 29,16.7 INTEGRATED-IA.26 | 17.52,23.58 17.49,23.58 13.45,27.62 U1.6
N$32  (via drill 0.35)
  Top 0.305: R22.2 59.63,22.05 R11.2 57.97,20.34 54.99,23.32 v54.99,24.83 | U2.2 47.71,34.28 v47.71,35.56 v47.7,35.56
  Bottom 0.305: v47.7,35.56 48.73,35.56 50.88,33.41 50.88,31.07 54.99,26.96 v54.99,24.83
N$33
  Top 0.305: U2.5 45.22,27.18 43.57,25.54 RFER3.2 39.89,25.54 CFE3.1 39.79,23.16 VINDIA22.1
N$34
  Top 0.305: RFER2.2 41.8,28.76 RFEL2.2 35.85,27.3 RFEL3.1 41.72,27.26 RFER3.1
N$36  (via drill 0.35)
  Top 0.305: CFE2.1 41.63,30.29 RFER2.1 41.79,30.51 41.79,32.3 | U2.3 46.46,34.26 46.46,35.31 46.21,35.56 43.98,35.56 41.79,33.37 41.79,32.3 | 41.79,32.3 42.74,33.25 v43.36,33.25 | VINDIA21.1 54.07,16.54 50.19,16.54 v47.81,18.92
  Bottom 0.305: v43.36,33.25 43.36,23.37 v47.81,18.92
N$38
  Top 0.305: RLM334_0.1 20.03,43.67 19.51,43.15 | INTEGRATED-IA.21 21.73,19.47 20.51,20.69 20.51,42.16 19.52,43.15 19.51,43.15 | 19.51,43.15 17.84,41.48 13.75,41.48 12.02,43.21 12.02,44.63 U4.6
N$39
  Top 0.305: CFE0.1 37.54,42.91 RFER0.1 37.8,44.45 39.13,45.78 | 39.13,45.78 41.4,45.78 42.28,44.91 U5.3 | VINDIA11.1 41.02,47.67 39.13,45.78
N$40
  Top 0.305: U5.5 41,37.48 40.41,36.89 RFER1.2 35.23,34.34 CFE1.1 36.59,34.14 37.07,33.66 VINDIA12.1
N$45
  Top 0.305: CFILT1.1 7.12,17.66 INPUT.2
VCC  (via drill 0.35)
  Top 0.152: 49.03,27.01 v49.04,27
  Top 0.305: 13.5,7.34 13.5,7.24 | 11.94,40 11.96,40 11.99,40.03 | 10.59,49.72 U4.4 | CIN_LDO.2 | U3.3 34.8,46.44 35.12,46.76 35.14,46.74 35.14,46.29 | U3.2 34.79,45.94 35.14,46.29 | U3.1 34.78,45.44 35.14,45.8 35.14,46.29 | 42.06,49.68 v42.09,49.68
  Top 0.508: VDD_GND_PINS.1 10.94,7.24 11.76,8.06 12.78,8.06 13.5,7.34 | VDD_GND_PINS.2 13.48,7.22 13.5,7.24 14.22,7.96 | VDD_GND_PINS.4 18.56,7.28 17.88,7.96 14.22,7.96 | 14.22,7.96 15.92,9.66 | 15.92,9.66 16.99,10.73 v16.99,10.81 17.05,10.75 36.8,10.75 46.81,20.76 v46.81,22.86 | v10.78,37.44 10.78,38.84 10.8,38.86 | 10.8,38.86 11.64,38.86 12.18,38.33 U1.4 | 10.8,38.86 11.94,40 | 11.99,40.03 11.99,40.04 8.9,43.13 8.9,49.29 | 8.9,49.29 9.33,49.72 10.59,49.72 | 8.9,49.29 8.9,50.03 10.04,51.17 34.67,51.17 | 34.67,51.17 34.64,51.2 40.54,51.2 | 34.67,51.17 36.91,48.93 CIN_LDO.2 | CIN_LDO.2 35.71,48.27 35.12,47.68 35.12,46.76 | 40.54,51.2 54.81,51.2 62.88,43.13 v65.69,43.13 65.69,43.74 67.53,45.58 R0.9V0.1 | 40.54,51.2 42.06,49.68 | U2.8 49.03,27.01 | U5.8 45.7,38.41 47.07,39.78 v47.07,40.6 | U6.8 67.58,30.33 v69.17,31.92 | v77.81,18.27 U7.8 | CVDD0.2 CVDD1.2 15.92,9.66
  Bottom 0.305: v49.04,27 49.03,26.99
  Bottom 0.508: v16.99,10.81 14,10.81 10.79,14.02 10.79,37.16 10.78,37.17 v10.78,37.44 | 49.03,26.99 49.03,25.03 46.86,22.86 | v42.09,49.68 43.22,48.55 43.22,44.45 v47.07,40.6 | v65.69,43.13 69.17,39.65 v69.17,31.92 | 46.86,22.86 v46.81,22.86 | 46.86,22.86 73.22,22.86 v77.81,18.27
VOUT_1
  Top 0.305: U6.1 R41.2 69.55,35.72 R_AAF_0.1 72.22,39.73 VOUTDIA1.1
VOUT_2
  Top 0.305: R42.2 67.83,13.13 66.36,14.61 66.36,26.77 64.14,29 U6.7 | R_AAF_2.2 70.02,10.41 R42.2 | R42.2 67.83,7.72 VOUTDIA2.1
VOUT_IA1
  Top 0.305: CFE0.2 33.94,43.08 REFL0.1 30.08,43.08 25.75,38.75 25.75,32.01 | INTEGRATED-IA.13 27.16,23.47 25.75,24.88 25.75,32.01 | VOUTIA1.1 25.75,32.01
VOUT_IA2
  Top 0.305: INTEGRATED-IA.12 26.95,25.55 26.95,27.87 | 26.95,27.87 26.95,30.4 28.84,32.29 28.85,32.29 | 28.85,32.29 31.37,34.81 RFEL1.2 | CFE1.2 33.55,34.12 33.55,33.37 32.47,32.29 28.85,32.29 | VOUTIA2.1 27.03,27.87 26.95,27.87
VOUT_IA2_BIS
  Top 0.305: INTEGRATED-IA.10 29.45,24.05 29.45,27.59 29.97,28.11 | 29.97,28.11 32.32,30.46 RFEL2.1 37.92,30.46 CFE2.2 | VOUTIA2BIS.1 29.97,28.11
VOUT_IA3
  Top 0.305: INTEGRATED-IA.9 30,24.38 30.88,25.26 35.59,25.26 RFEL3.2 35.89,25.44 CFE3.2 38.09,20.48 VOUTIA3.1
VREF_0.9V  (via drill 0.35)
  Top 0.305: R43.2 v58.44,28.84 v58.43,28.83 | R0.9V1.1 66.73,54.29 CREF1.1 | CREF1.1 66.73,50.75 66.08,50.09 | R0.9V0.2 67.53,48.64 66.08,50.09 | CREF1.1 64.42,51.58 63.77,52.23 0.9VREF.1 61.32,51.54 R40.2 62.5,50.32 63.43,49.39 63.49,49.45 | v63.49,48.42 63.49,49.45 | 63.49,49.45 64.14,50.09 66.08,50.09
  Bottom 0.305: v58.43,28.83 59.09,28.17 59.8,28.17 63.49,31.86 v63.49,48.42

### Text on the board
bNames: PCB epilepsy TFE | Chen Jaminon-De Roeck | 2020-2021
bDocu: TFE epilepsy : Integrated IA + Discrete IA + AAF for Appolo bllue3 Ambiq | Chen Jaminon-De Roeck 2021